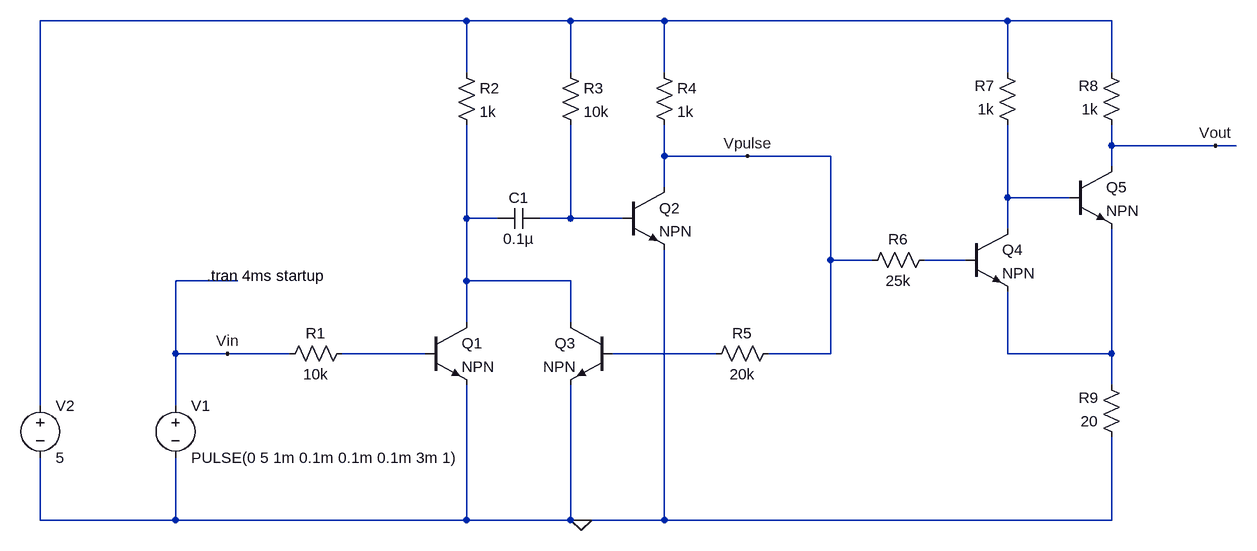
[diagram p0: schematic simple_pulse_generator.asc]
simple_pulse_generator.asc, the LTspice schematic file:
Version 4
SHEET 1 1304 688
WIRE 96 -96 -560 -96
WIRE 256 -96 96 -96
WIRE 400 -96 256 -96
WIRE 928 -96 400 -96
WIRE 1088 -96 928 -96
WIRE 96 -16 96 -96
WIRE 256 -16 256 -96
WIRE 400 -16 400 -96
WIRE 928 -16 928 -96
WIRE 1088 -16 1088 -96
WIRE 1088 96 1088 64
WIRE 1248 96 1088 96
WIRE 1280 96 1248 96
WIRE 400 112 400 64
WIRE 528 112 400 112
WIRE 656 112 528 112
WIRE 1088 128 1088 96
WIRE 400 160 400 112
WIRE 928 176 928 64
WIRE 1024 176 928 176
WIRE 96 208 96 64
WIRE 144 208 96 208
WIRE 256 208 256 64
WIRE 256 208 208 208
WIRE 336 208 256 208
WIRE 928 224 928 176
WIRE 656 272 656 112
WIRE 720 272 656 272
WIRE 864 272 800 272
WIRE -256 304 -352 304
WIRE 96 304 96 208
WIRE 256 304 96 304
WIRE 96 368 96 304
WIRE 256 368 256 304
WIRE -352 416 -352 304
WIRE -272 416 -352 416
WIRE -176 416 -272 416
WIRE 32 416 -96 416
WIRE 480 416 320 416
WIRE 656 416 656 272
WIRE 656 416 560 416
WIRE 928 416 928 320
WIRE 1088 416 1088 224
WIRE 1088 416 928 416
WIRE 1088 464 1088 416
WIRE -560 496 -560 -96
WIRE -352 496 -352 416
WIRE -560 672 -560 576
WIRE -352 672 -352 576
WIRE -352 672 -560 672
WIRE 96 672 96 464
WIRE 96 672 -352 672
WIRE 256 672 256 464
WIRE 256 672 96 672
WIRE 272 672 256 672
WIRE 400 672 400 256
WIRE 400 672 272 672
WIRE 1088 672 1088 544
WIRE 1088 672 400 672
FLAG -272 416 Vin
FLAG 528 112 Vpulse
FLAG 1248 96 Vout
FLAG 272 672 0
SYMBOL npn 32 368 R0
SYMATTR InstName Q1
SYMBOL npn 336 160 R0
SYMATTR InstName Q2
SYMBOL npn 864 224 R0
SYMATTR InstName Q4
SYMBOL npn 320 368 M0
SYMATTR InstName Q3
SYMBOL npn 1024 128 R0
SYMATTR InstName Q5
SYMBOL res 80 -32 R0
SYMATTR InstName R2
SYMATTR Value 1k
SYMBOL res 240 -32 R0
SYMATTR InstName R3
SYMATTR Value 10k
SYMBOL res 384 -32 R0
SYMATTR InstName R4
SYMATTR Value 1k
SYMBOL res -80 400 R90
WINDOW 0 0 56 VBottom 2
WINDOW 3 32 56 VTop 2
SYMATTR InstName R1
SYMATTR Value 10k
SYMBOL cap 208 192 R90
WINDOW 0 0 32 VBottom 2
WINDOW 3 32 32 VTop 2
SYMATTR InstName C1
SYMATTR Value 0.1µ
SYMBOL voltage -352 480 R0
SYMATTR InstName V1
SYMATTR Value PULSE(0 5 1m 0.1m 0.1m 0.1m 3m 1)
SYMBOL voltage -560 480 R0
SYMATTR InstName V2
SYMATTR Value 5
SYMBOL res 576 400 R90
WINDOW 0 0 56 VBottom 2
WINDOW 3 32 56 VTop 2
SYMATTR InstName R5
SYMATTR Value 20k
SYMBOL res 816 256 R90
WINDOW 0 0 56 VBottom 2
WINDOW 3 32 56 VTop 2
SYMATTR InstName R6
SYMATTR Value 25k
SYMBOL res 944 80 R180
WINDOW 0 36 76 Left 2
WINDOW 3 36 40 Left 2
SYMATTR InstName R7
SYMATTR Value 1k
SYMBOL res 1104 80 R180
WINDOW 0 36 76 Left 2
WINDOW 3 36 40 Left 2
SYMATTR InstName R8
SYMATTR Value 1k
SYMBOL res 1104 560 R180
WINDOW 0 36 76 Left 2
WINDOW 3 36 40 Left 2
SYMATTR InstName R9
SYMATTR Value 20
TEXT -304 296 Left 2 !.tran 4ms startup

The netlist it stands for:
* simple_pulse_generator.asc
Q1 N003 N006 0 0 NPN
Q2 Vpulse N004 0 0 NPN
Q4 N002 N005 N008 0 NPN
Q3 N003 N007 0 0 NPN
Q5 Vout N002 N008 0 NPN
R2 N001 N003 1k
R3 N001 N004 10k
R4 N001 Vpulse 1k
R1 N006 Vin 10k
C1 N004 N003 0.1µ
V1 Vin 0 PULSE(0 5 1m 0.1m 0.1m 0.1m 3m 1)
V2 N001 0 5
R5 Vpulse N007 20k
R6 N005 Vpulse 25k
R7 N002 N001 1k
R8 Vout N001 1k
R9 0 N008 20
.model NPN NPN
.model PNP PNP
.lib standard.bjt
.tran 4ms startup
.backanno
.end